# Altium schematic sheet DWM1000.SchDoc
size A4; SheetNumber: 8; SheetTotal: 10
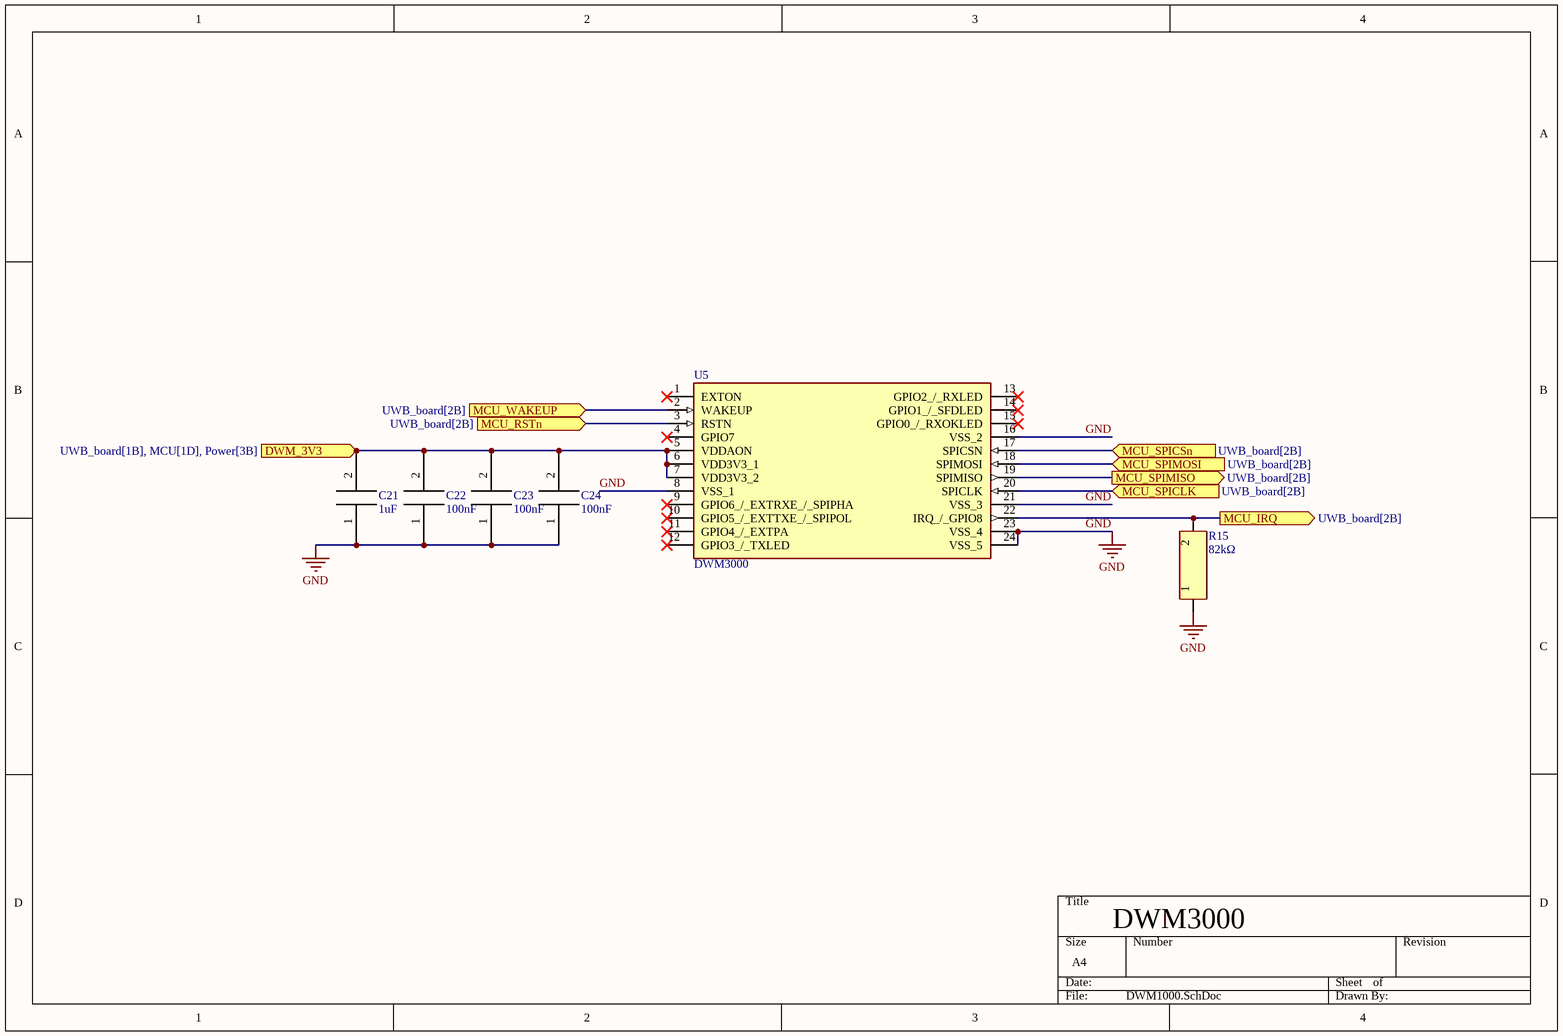
[diagram p0: DWM1000.SchDoc]

## Parts
C21  1uF  [0603_cap]
C22  100nF  [0603_cap]
C23  100nF  [0603_cap]
C24  100nF  [0603_cap]
R15  value 82kΩ  [0603_res]  (hidden comment: 82k)
U5  DWM3000  [DWM1000]

## Ports
DWM_3V3 (in, see UWB_board[1B], MCU[1D], Power[3B]), MCU_IRQ (out, see UWB_board[2B]), MCU_RSTn (in, see UWB_board[2B]), MCU_SPICLK (in, see UWB_board[2B]), MCU_SPICSn (in, see UWB_board[2B]), MCU_SPIMISO (out, see UWB_board[2B]), MCU_SPIMOSI (in, see UWB_board[2B]), MCU_WAKEUP (in, see UWB_board[2B])

## Nets
GND: C21.1 C22.1 C23.1 C24.1 R15.1 U5.8(VSS_1) U5.16(VSS_2) U5.21(VSS_3) U5.23(VSS_4) U5.24(VSS_5)
DWM_3V3: C21.2 C22.2 C23.2 C24.2 U5.5(VDDAON) U5.6(VDD3V3_1) U5.7(VDD3V3_2) ; port DWM_3V3
MCU_IRQ: R15.2 U5.22(IRQ_/_GPIO8) ; port MCU_IRQ
MCU_RSTn: U5.3(RSTN) ; port MCU_RSTn
MCU_SPICLK: U5.20(SPICLK) ; port MCU_SPICLK
MCU_SPICSn: U5.17(SPICSN) ; port MCU_SPICSn
MCU_SPIMISO: U5.19(SPIMISO) ; port MCU_SPIMISO
MCU_SPIMOSI: U5.18(SPIMOSI) ; port MCU_SPIMOSI
MCU_WAKEUP: U5.2(WAKEUP) ; port MCU_WAKEUP

Not connected (* = marked no-connect by the designer): U5 1(EXTON)* 4(GPIO7)* 9(GPIO6_/_EXTRXE_/_SPIPHA)* 10(GPIO5_/_EXTTXE_/_SPIPOL)* 11(GPIO4_/_EXTPA)* 12(GPIO3_/_TXLED)* 13(GPIO2_/_RXLED)* 14(GPIO1_/_SFDLED)* 15(GPIO0_/_RXOKLED)*

## Notes on the sheet
- DWM3000

## Library data of the parts
C21 = CL10A105KB8NNNC: 1uF 50V X5R ±10% 0603 Multilayer Ceramic Capacitors MLCC - SMD/SMT ROHS; LCSC Part #: C15849; Value: 1uF
C22-C24 = CC0603KRX7R9BB104: 100nF 50V X7R ±10% 0603 Multilayer Ceramic Capacitors MLCC - SMD/SMT ROHS; LCSC Part #: C14663; Value: 100nF
R15 = 0603WAF8202T5E: 82kΩ -55℃~+155℃ 100mW 75V Thick Film Resistor ±1% ±100ppm/℃ 0603 Chip Resistor - Surface Mount ROHS; LCSC Part #: C23254
U5 = DWM1000: 3.5 - 6.5 GHz Ultra-Wideband (UWB) Transceiver Module; Manufacturer_Name: Qorvo; Geometry.Height: 3.15mm; Mouser Part Number: 772-DWM1000; Mouser Price/Stock: https://www.mouser.co.uk/ProductDetail/Qorvo/DWM1000?qs=TiOZkKH1s2R6b5D6df63Pg%3D%3D; Manufacturer_Part_Number: DWM1000; Datasheet Link: https://www.qorvo.com/products/d/da007948